# Altium schematic sheet B5PLMF_MAR_HF_B9.SchDoc
size A4; Organization: BME AUT; Address1: Magyar tudósok krt. 2.; Address2: Q épület; Address3: Budapest; Address4: H-1117; DocumentNumber: 1; SheetNumber: 1; SheetTotal: 2
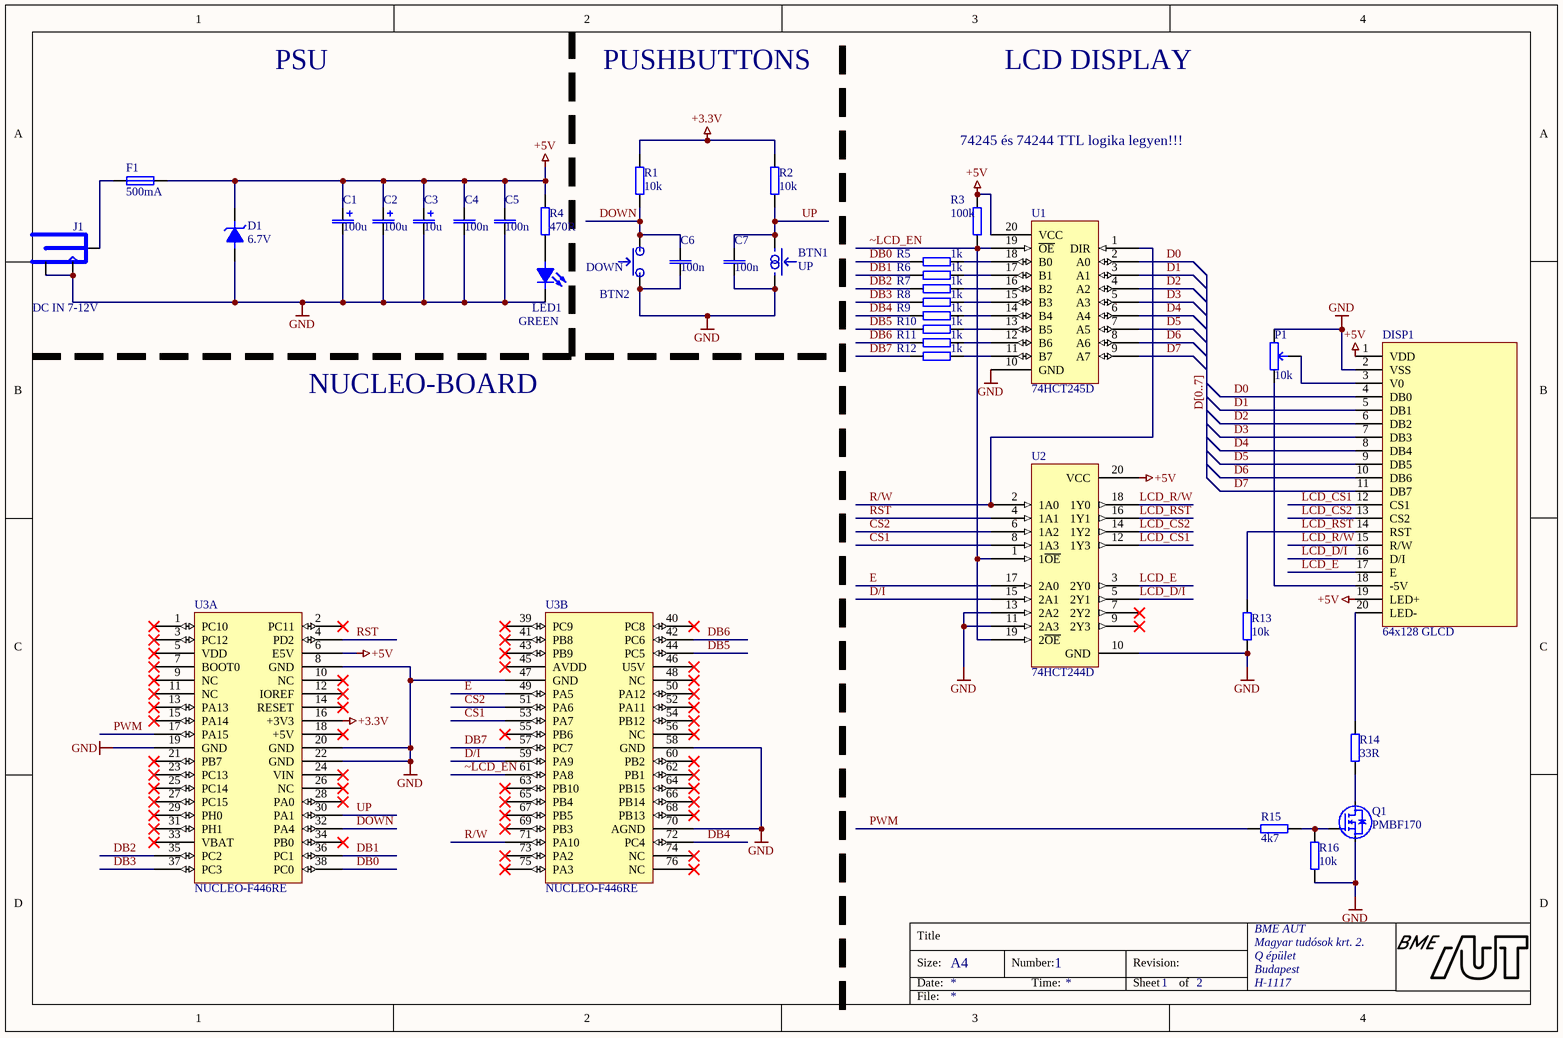
[diagram p0: B5PLMF_MAR_HF_B9.SchDoc]

## Parts
BTN1  UP  [PBUTTON_SMD]
BTN2  DOWN  [PBUTTON_SMD]
C1  100u  [D8 ELKO]
C2  100u  [D8 ELKO]
C3  10u  [CAP 1210]
C4  100n  [CAP 0805]
C5  100n  [CAP 0805]
C6  100n  [CAP 0805]
C7  100n  [CAP 0805]
D1  6.7V  [DO-214AC]
DISP1  64x128 GLCD  [64128Q]
F1  500mA  [FUSE1812]
J1  DC IN 7-12V  [DC POWER CONNECTOR]
LED1  GREEN  [LED 0805G]
P1  10k  [PT10]
Q1  PMBF170  [SOT23]
R1  10k  [RES 0805]
R2  10k  [RES 0805]
R3  100k  [RES 0805]
R4  470R  [RES 0805]
R5  1k  [RES 0805]
R6  1k  [RES 0805]
R7  1k  [RES 0805]
R8  1k  [RES 0805]
R9  1k  [RES 0805]
R10  1k  [RES 0805]
R11  1k  [RES 0805]
R12  1k  [RES 0805]
R13  10k  [RES 0805]
R14  33R  [RES 0805]
R15  4k7  [RES 0805]
R16  10k  [RES 0805]
U1  74HCT245D  [SO20]
U2  74HCT244D  [SO20]
U3  NUCLEO-F446RE  [STM32F4xx_Nucleo]  (parts A,B of 2)

## Nets
+3.3V: R1.2 R2.2 U3.16(+3V3)
+5V: C1.1(+) C2.1(+) C3.1(+) C4.2 C5.2 D1.2(K) DISP1.1(VDD) DISP1.19(LED+) F1.2 R3.2 R4.2 U1.20(VCC) U2.20(VCC) U3.6(E5V)
GND: BTN1.1 BTN2.1 C1.2(-) C2.2(-) C3.2(-) C4.1 C5.1 C6.1 C7.1 D1.1(A) DISP1.2(VSS) J1.2(GND) J1.3(GND) LED1.2(K) P1.2 Q1.2(S) R13.1 R16.1 U1.10(GND) U2.10(GND) U2.11(2A3) U2.13(2A2) U3.8(GND) U3.19(GND) U3.20(GND) U3.22(GND) U3.47(GND) U3.58(GND) U3.70(AGND)
CS1: U2.8(1A3) U3.53(PA7)
CS2: U2.6(1A2) U3.51(PA6)
D0: DISP1.4(DB0) U1.2(A0)
D1: DISP1.5(DB1) U1.3(A1)
D2: DISP1.6(DB2) U1.4(A2)
D3: DISP1.7(DB3) U1.5(A3)
D4: DISP1.8(DB4) U1.6(A4)
D5: DISP1.9(DB5) U1.7(A5)
D6: DISP1.10(DB6) U1.8(A6)
D7: DISP1.11(DB7) U1.9(A7)
D/I: U2.15(2A1) U3.59(PA9)
DB0: R5.2 U3.38(PC0)
DB1: R6.2 U3.36(PC1)
DB2: R7.2 U3.35(PC2)
DB3: R8.2 U3.37(PC3)
DB4: R9.2 U3.72(PC4)
DB5: R10.2 U3.44(PC5)
DB6: R11.2 U3.42(PC6)
DB7: R12.2 U3.57(PC7)
DOWN: BTN2.2 C6.2 R1.1 U3.32(PA4)
E: U2.17(2A0) U3.49(PA5)
LCD_CS1: DISP1.12(CS1) U2.12(1Y3)
LCD_CS2: DISP1.13(CS2) U2.14(1Y2)
LCD_D/I: DISP1.16(D/I) U2.5(2Y1)
LCD_E: DISP1.17(E) U2.3(2Y0)
LCD_R/W: DISP1.15(R/W) U2.18(1Y0)
LCD_RST: DISP1.14(RST) R13.2 U2.16(1Y1)
PWM: R15.2 U3.17(PA15)
R/W: U1.1(DIR) U2.2(1A0) U3.71(PA10)
RST: U2.4(1A1) U3.4(PD2)
UP: BTN1.2 C7.2 R2.1 U3.30(PA1)
~LCD_EN: R3.1 U1.19(~{OE}) U2.1(1~{OE}) U2.19(2~{OE}) U3.61(PA8)
NetDISP1_3: DISP1.3(V0) P1.3
NetDISP1_18: DISP1.18(-5V) P1.1
NetDISP1_20: DISP1.20(LED-) R14.2
NetF1_1: F1.1 J1.1(9V)
NetLED1_1: LED1.1(A) R4.1
NetQ1_1: Q1.1(G) R15.1 R16.2
NetQ1_3: Q1.3(D) R14.1
NetR5_1: R5.1 U1.18(B0)
NetR6_1: R6.1 U1.17(B1)
NetR7_1: R7.1 U1.16(B2)
NetR8_1: R8.1 U1.15(B3)
NetR9_1: R9.1 U1.14(B4)
NetR10_1: R10.1 U1.13(B5)
NetR11_1: R11.1 U1.12(B6)
NetR12_1: R12.1 U1.11(B7)

Not connected (* = marked no-connect by the designer): U2 7(2Y2)* 9(2Y3)*; U3 1(PC10)* 2(PC11)* 3(PC12)* 5(VDD)* 7(BOOT0)* 9(NC)* 10(NC)* 11(NC)* 12(IOREF)* 13(PA13)* 14(RESET)* 15(PA14)* 18(+5V)* 21(PB7)* 23(PC13)* 24(VIN)* 25(PC14)* 26(NC)* 27(PC15)* 28(PA0)* 29(PH0)* 31(PH1)* 33(VBAT)* 34(PB0)* 39(PC9)* 40(PC8)* 41(PB8)* 43(PB9)* 45(AVDD)* 46(U5V)* 48(NC)* 50(PA12)* 52(PA11)* 54(PB12)* 55(PB6)* 56(NC)* 60(PB2)* 62(PB1)* 63(PB10)* 64(PB15)* 65(PB4)* 66(PB14)* 67(PB5)* 68(PB13)* 69(PB3)* 73(PA2)* 74(NC)* 75(PA3)* 76(NC)*

## Buses and harness runs
bus D[0..7]

## Notes on the sheet
- PSU
- PUSHBUTTONS
- LCD DISPLAY
- 74245 és 74244 TTL logika legyen!!!
- NUCLEO-BOARD
- Title
- Size:
- Date:
- A4
- Number:
- Time:
- Revision:
- Sheet
- of
- File:

## Library data of the parts
BTN1 BTN2 = PUSHBUTTON: Tactile push button; Reference: 45-05-43; Supplier: LOMEX
  BTN1: VALUE: UP
  BTN2: VALUE: DOWN
C1-C3 = CAP_POL: POLARIZED CAPACITOR; Supplier: LOMEX
  C1 C2: Reference: 91-00-90; VALUE: 100u
  C3: Reference: 92-01-13; VALUE: 10u
C4-C7 = CAP: NON POLARIZED CAPACITOR; VALUE: 100n; Reference: 82-01-25; Supplier: LOMEX
D1 = SUPRESSOR DIODE: Reference: 96-00-75; VALUE: 6.7V; Supplier: LOMEX
DISP1 = 64128QCCBW-3LP: 64x128 pixel graphical LCD display from Displaytech; Supplier: LOMEX; Reference: 37-00-71; VALUE: 64x128 GLCD
F1 = FUSE: Reference: 44-02-32; VALUE: 500mA; Supplier: LOMEX
J1 = DC POWER CONN: DC POWER CONNECTOR 5.5/2.1/9.5mm; Supplier: LOMEX; Reference: 43-07-67; VALUE: DC IN 7-12V
LED1 = LED: Reference: 95-01-09; VALUE: GREEN; Supplier: LOMEX
P1 = POT: RESISTOR; Reference: 05-07-33; Supplier: LOMEX; VALUE: 10k
Q1 = PMBF170: N-Channel MOSFET; Reference: 86-01-96; VALUE: PMBF170; Supplier: LOMEX
R1-R16 = RES: RESISTOR; Supplier: LOMEX
  R1 R2 R13 R16: Reference: 81-10-99; VALUE: 10k
  R3: Reference: 81-11-11; VALUE: 100k
  R4: Reference: 81-10-83; VALUE: 470R
  R5-R12: Reference: 81-10-87; VALUE: 1k
  R14: Reference: 81-28-06; VALUE: 33R
  R15: Reference: 81-28-05; VALUE: 4k7
U1 = 74HCT245: 8x Bidirectional bus transciever; Reference: 1085315; Name: 74HCT245D  Transceiver, 74HCT245; Supplier: Farnell; VALUE: 74HCT245D
U2 = 74HCT244D: 8xBuffer/Line Driver; Reference: 2444943; Name: 74HCT244D-Q100,118  Buffer / Line Driver, 74HCT244; Supplier: Farnell; VALUE: 74HCT244D
U3 = NUCLEO-F446RE: STM32F4xx Nucleo board; Name: Nucleo F446RE; VALUE: STM32F4 NUCLEO; Supplier: Tanszék; Reference: NUCLEO